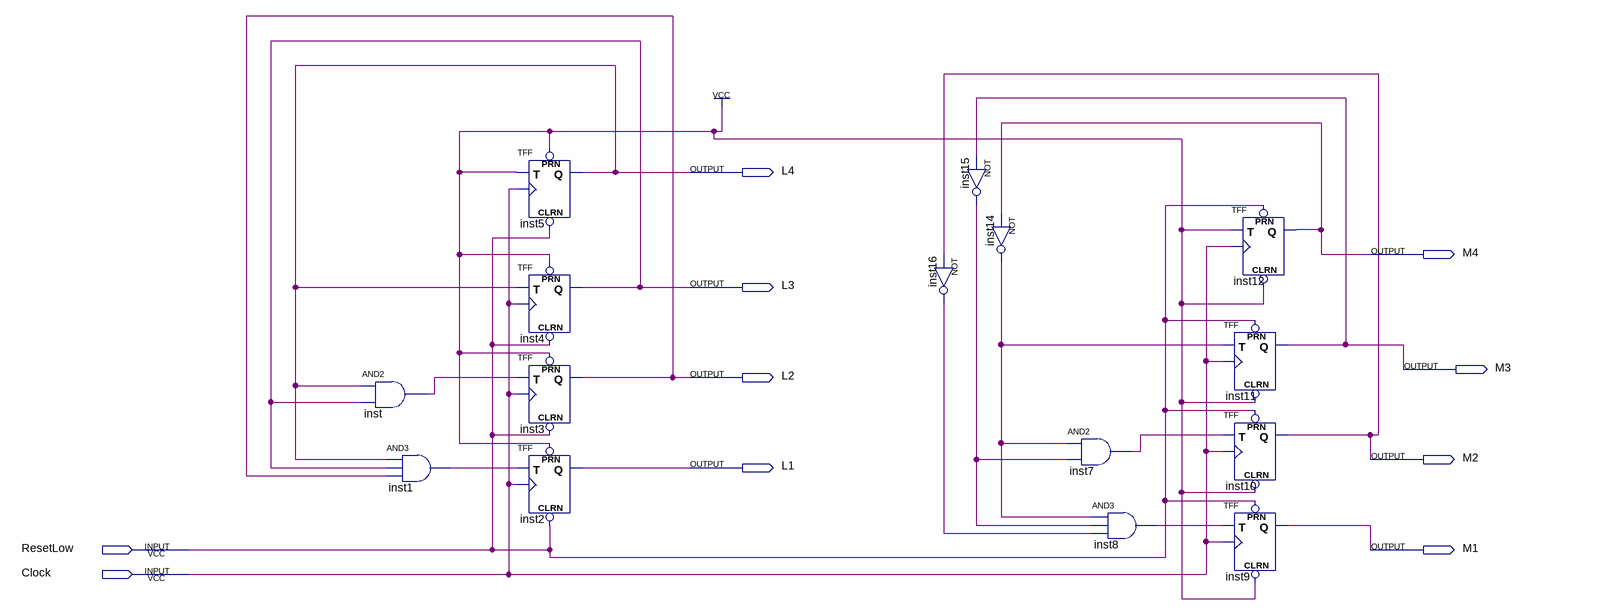
[diagram p0: schematic sheet]
// Quartus schematic Lab3.bdf as structural Verilog: 15 symbols, 10 pins
module Lab3 (
  input  ResetLow,
  input  Clock,
  output L4,
  output M4,
  output L3,
  output M3,
  output L2,
  output M2,
  output L1,
  output M1
);

  wire inst1_out, inst7_out, inst8_out, inst14_out, inst15_out, inst16_out, inst_out;

  and inst (inst_out, L4, L3);
  and inst1 (inst1_out, L4, L3, L2);
  TFF inst5 (.PRN(1'b1), .CLRN(ResetLow), .T(1'b1), .CLK(Clock), .Q(L4));
  TFF inst4 (.PRN(1'b1), .CLRN(ResetLow), .T(L4), .CLK(Clock), .Q(L3));
  TFF inst3 (.PRN(1'b1), .CLRN(ResetLow), .T(inst_out), .CLK(Clock), .Q(L2));
  TFF inst2 (.PRN(1'b1), .CLRN(ResetLow), .T(inst1_out), .CLK(Clock), .Q(L1));
  not inst15 (inst15_out, M3);
  not inst16 (inst16_out, M2);
  not inst14 (inst14_out, M4);
  and inst7 (inst7_out, inst14_out, inst15_out);
  and inst8 (inst8_out, inst14_out, inst15_out, inst16_out);
  TFF inst12 (.PRN(ResetLow), .CLRN(1'b1), .T(1'b1), .CLK(Clock), .Q(M4));
  TFF inst11 (.PRN(ResetLow), .CLRN(1'b1), .T(inst14_out), .CLK(Clock), .Q(M3));
  TFF inst10 (.PRN(ResetLow), .CLRN(1'b1), .T(inst7_out), .CLK(Clock), .Q(M2));
  TFF inst9 (.PRN(ResetLow), .CLRN(1'b1), .T(inst8_out), .CLK(Clock), .Q(M1));
endmodule
